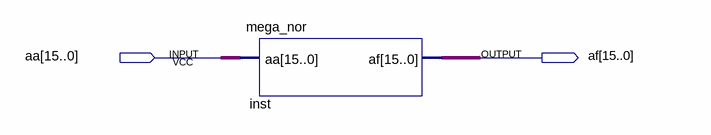
[diagram p0: schematic sheet]
// Quartus schematic mega_nora.bdf as structural Verilog: 1 symbols, 2 pins
module mega_nora (
  input  [15:0] aa,
  output [15:0] af
);

  mega_nor inst (.aa(aa), .af(af));
endmodule
